# Altium project R_BOARD.PrjPcb
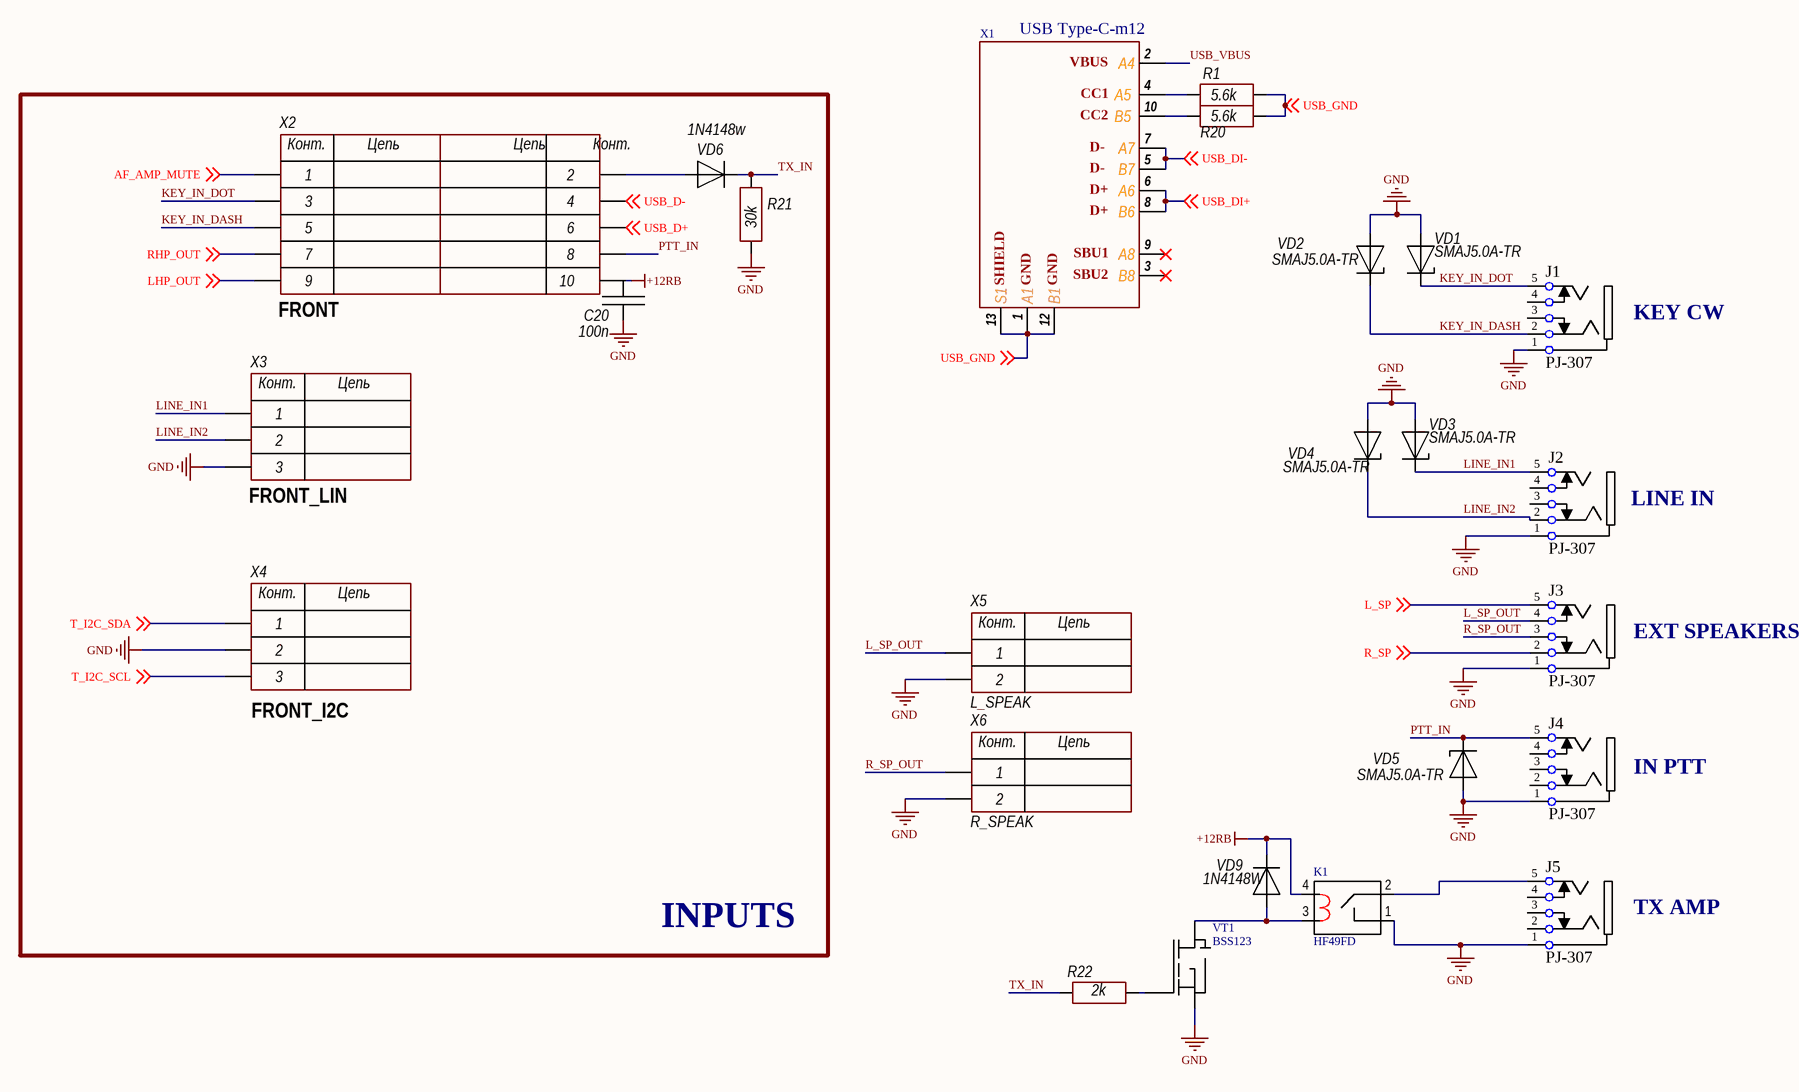
[diagram p0: RB_Conn.SchDoc]
3 sheets, 102 parts. Net scope: global (net labels, ports and power ports of the same name join across sheets).
Board file: PCB_R_Board.PcbDoc
Sheets:
  RB_Conn.SchDoc
  RB_Power.SchDoc
  RB_Audio.SchDoc

## Sheet RB_Conn.SchDoc
size 420 x 297 mm; ApprovedBy: UA3REO; Author: RU4PN; CompanyName: Wolf-2; DocumentNumber: R_BOARD - Connectors; Revision: 0.1; SheetNumber: 1; SheetTotal: 3

### Parts
C20  100n  [CH0805C]
J1  PJ-307  [PJ-307]
J2  PJ-307  [PJ-307]
J3  PJ-307  [PJ-307]
J4  PJ-307  [PJ-307]
J5  PJ-307  [PJ-307]
K1  HF49FD  [HF49FD]
R1  5.6k  [CH0805R]
R20  5.6k  [CH0805R]
R21  30k  [CH0805R]
R22  2k  [CH0805R]
VD1  SMAJ5.0A-TR  [SMA]
VD2  SMAJ5.0A-TR  [SMA]
VD3  SMAJ5.0A-TR  [SMA]
VD4  SMAJ5.0A-TR  [SMA]
VD5  SMAJ5.0A-TR  [SMA]
VD6  1N4148w  [SOD323]
VD9  1N4148W  [SOD123]
VT1  BSS123  [SOT23_132]
X1  USB Type-C-m12  [PCBComponent_1]
X2  FRONT  [CON: BH-10]
X3  FRONT_LIN  [CON: CWF-3]
X4  FRONT_I2C  [CON: CWF-3]
X5  L_SPEAK  [CON: PLS-2]
X6  R_SPEAK  [CON: PLS-2]

### Blocks framed on the sheet
INPUTS: C20 R21 VD6 X2-X4

### Nets
+12RB: K1.4 VD9.2 X2.10
GND: C20.1 J1.1 J2.1 J3.1 J4.1 J5.1 K1.1 R21.1 VD1.1(A) VD2.1(A) VD3.1(A) VD4.1(A) VD5.1(A) VT1.2(S) X3.3 X4.2 X5.2 X6.2
AF_AMP_MUTE: X2.1 ; off-sheet AF_AMP_MUTE
KEY_IN_DASH: J1.2 VD2.2(C) X2.5
KEY_IN_DOT: J1.5 VD1.2(C) X2.3
L_SP: J3.5 ; off-sheet L_SP
L_SP_OUT: J3.4 X5.1
LHP_OUT: X2.9 ; off-sheet LHP_OUT
LINE_IN1: J2.5 VD3.2(C) X3.1
LINE_IN2: J2.2 VD4.2(C) X3.2
PTT_IN: J4.5 VD5.2(C) X2.8
R_SP: J3.2 ; off-sheet R_SP
R_SP_OUT: J3.3 X6.1
RHP_OUT: X2.7 ; off-sheet RHP_OUT
T_I2C_SCL: X4.3 ; off-sheet T_I2C_SCL
T_I2C_SDA: X4.1 ; off-sheet T_I2C_SDA
TX_IN: R21.2 R22.1 VD6.2
USB_D+: X2.6 ; off-sheet USB_D+
USB_D-: X2.4 ; off-sheet USB_D-
USB_DI+: X1.6(A6) X1.8(B6) ; off-sheet USB_DI+
USB_DI-: X1.5(B7) X1.7(A7) ; off-sheet USB_DI-
USB_GND: R1.2 R20.2 X1.1(A1) X1.12(B1) X1.13(S1) ; off-sheet USB_GND
USB_VBUS: X1.2(A4)
NetJ5_5: J5.5 K1.2
NetK1_3: K1.3 VD9.1 VT1.3(D)
NetR1_1: R1.1 X1.4(A5)
NetR20_1: R20.1 X1.10(B5)
NetR22_2: R22.2 VT1.1(G)
NetVD6_1: VD6.1 X2.2

Not connected (* = marked no-connect by the designer): C20 2; J1 3 4; J2 3 4; J4 2 3 4; J5 2 3 4; X1 3(B8)* 9(A8)*

### Notes on the sheet
- KEY CW
- LINE IN
- EXT SPEAKERS
- IN PTT
- TX AMP
- Перв. примен.
- Справ. №
- Подп. и дата
- Инв. № дубл.
- Взам. инв. №
- Разраб.
- Изм.
- Лист
- № докум.
- Подп.
- Дата
- Лит.
- Масса
- Масштаб
- Пров.
- Т.контр.
- Листов
- Инв. № подл.
- Утв.
- Н.контр.
- 2.106-A3
- Копировал
- Формат А3
- (in symbol 2-Connector) Конт.; Цепь
- (in symbol 3-Connector) Конт.; Цепь
- (in symbol 10(2)-Connector) Конт.; Цепь
- (in symbol USB-C_2.0) VBUS; CC1; CC2; D-; D+; SBU1; SBU2; SHIELD; GND

### Library data of the parts
C20 = Capacitor: Manufacturer: *; Model: *; HelpURL: *; ComponentKind: *; Value: *
J1 = JACK_Audio-3: KEY
J2 = JACK_Audio-3: LIN
J3 = JACK_Audio-3: OUT_SPEAKERS
J4 = JACK_Audio-3: PTT_IN
J5 = JACK_Audio-3: TX
K1 = HF49FD 012-1H12
R1 R20-R22 = Resistor: Manufacturer: *; Model: *; HelpURL: *; ComponentKind: *; Value: *
VD1-VD5 = Diod Zener: ComponentKind: *; Manufacturer: *; Model: *; HelpURL: *
VD6 VD9 = Diod: ComponentKind: *; Manufacturer: *; Model: *; HelpURL: *
X1 = USB-C_2.0
X2 = 10(2)-Connector: Model: *; Manufacturer: *; HelpURL: *; ComponentKind: *
X3 X4 = 3-Connector: Model: *; Manufacturer: *; HelpURL: *; ComponentKind: *
X5 X6 = 2-Connector: Model: *; Manufacturer: *; HelpURL: *; ComponentKind: *

## Sheet RB_Power.SchDoc
size 420 x 297 mm; ApprovedBy: UA3REO; Author: RU4PN; CompanyName: Wolf 2; DocumentNumber: R_BOARD - Power; SheetNumber: 2; SheetTotal: 3
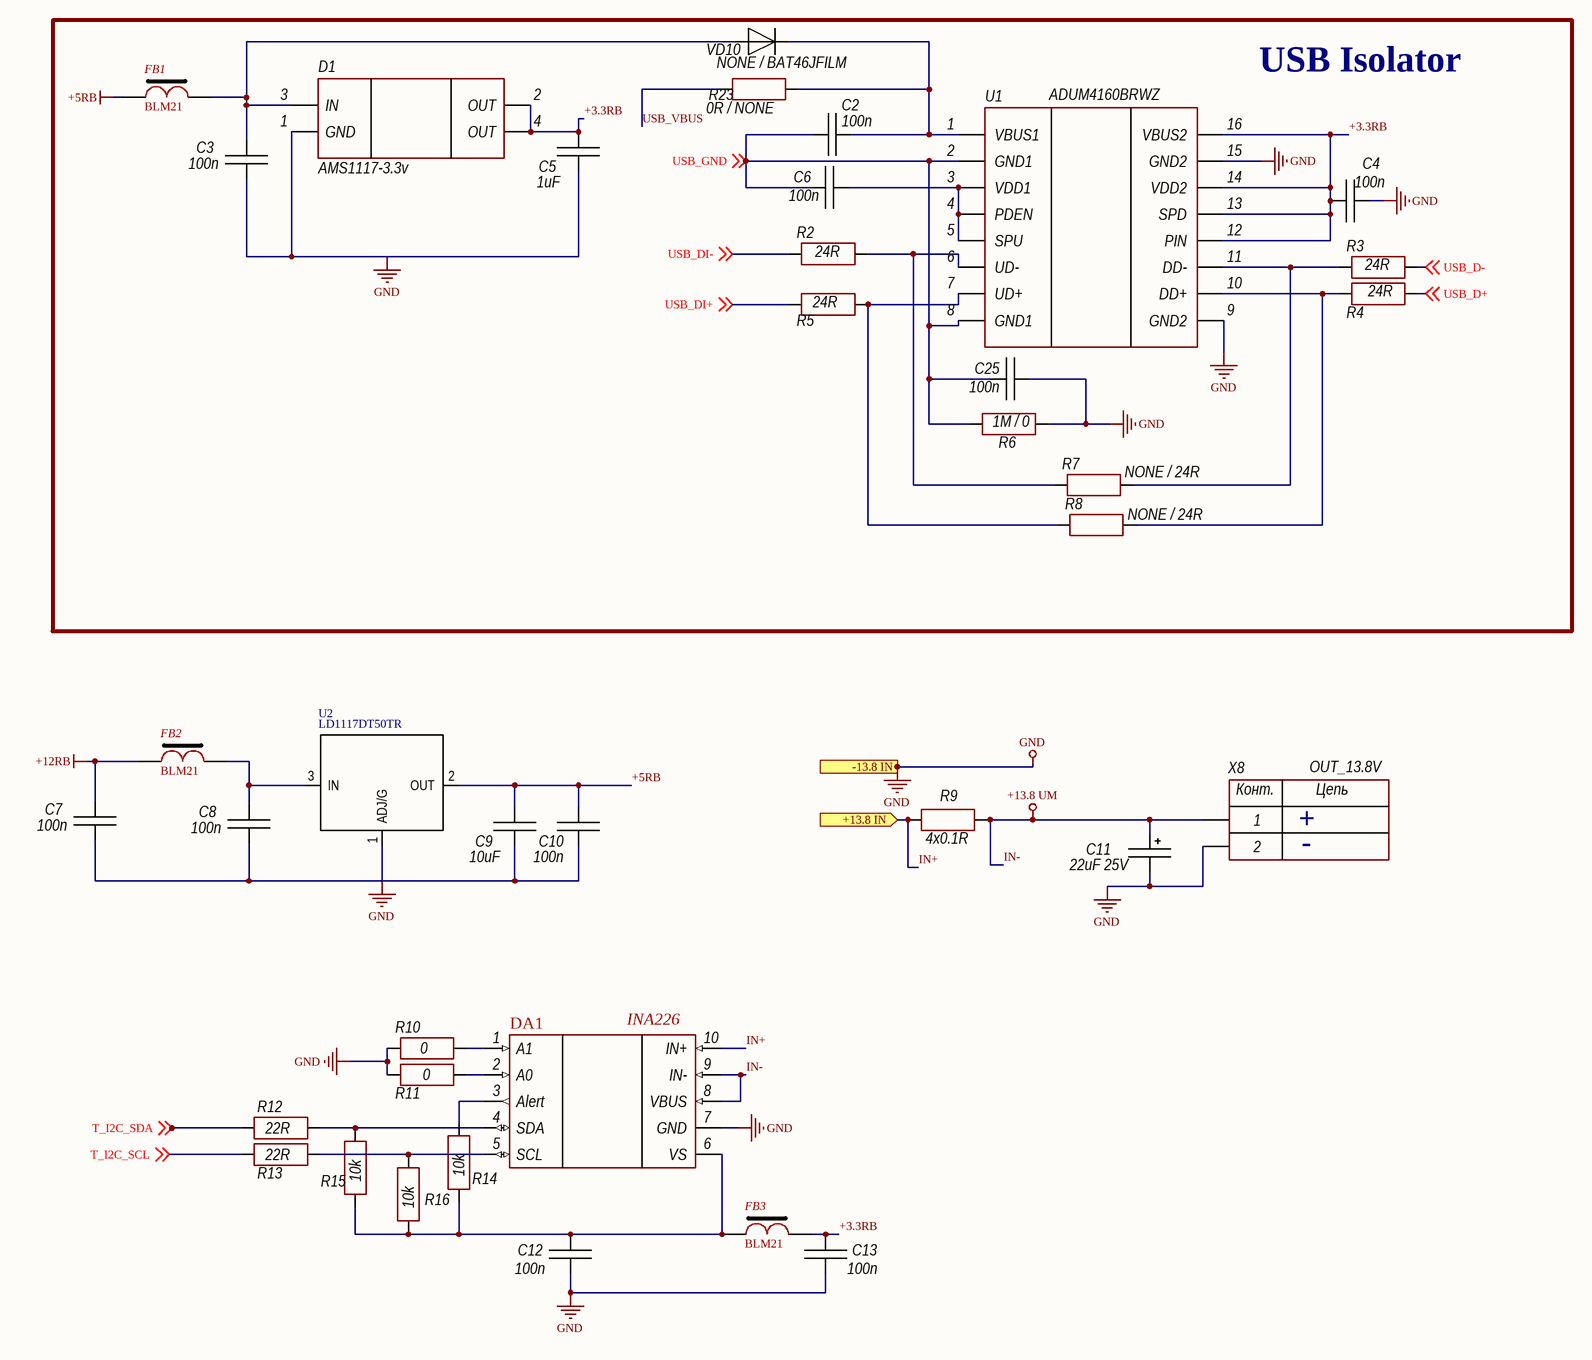
[diagram p1: RB_Power.SchDoc]

### Parts
C2  100n  [CH0805C]
C3  100n  [CH0805C]
C4  100n  [CH0805C]
C5  1uF  [CH0805C]
C6  100n  [CH0805C]
C7  100n  [CH0805C]
C8  100n  [CH0805C]
C9  10uF  [CH0805C]
C10  100n  [CH0805C]
C11  22uF 25V  [TANTAL_D]
C12  100n  [CH0805C]
C13  100n  [CH0805C]
C25  100n  [CH0805C]
D1  AMS1117-3.3v  [SOT223]
DA1  INA226  [10-TSSOP]
FB1  BLM21  [CH0805L]
FB2  BLM21  [CH0805L]
FB3  BLM21  [CH0805L]
R2  24R  [CH0805R]
R3  24R  [CH0805R]
R4  24R  [CH0805R]
R5  24R  [CH0805R]
R6  1M / 0  [CH0805R]
R7  NONE / 24R  [CH0805R]
R8  NONE / 24R  [CH0805R]
R9  4x0.1R  [R-DIP]
R10  0  [CH0805R]
R11  0  [CH0805R]
R12  22R  [CH0805R]
R13  22R  [CH0805R]
R14  10k  [CH0805R]
R15  10k  [CH0805R]
R16  10k  [CH0805R]
R23  0R / NONE  [CH0805R]
U1  ADUM4160BRWZ  [16-SOIC(W)]
U2  LD1117DT50TR  [TO-263-3(123)]
VD10  NONE / BAT46JFILM  [SOD323]
X8  OUT_13.8V  [CON: WF-02]

### Blocks framed on the sheet
USB Isolator: C2-C6 C25 D1 FB1 R2-R8 R23 U1 VD10

### Ports
+13.8 IN (in), -13.8 IN

### Nets
+5RB: C9.2 C10.2 FB1.2 U2.2(OUT)
+12RB: C7.2 FB2.2
+13.8 UM: C11.1 DA1.8(VBUS) DA1.9(IN-) R9.2 X8.1  [also labelled IN-]
GND: C3.1 C4.2 C5.1 C7.1 C8.1 C9.1 C10.1 C11.2 C12.1 C13.1 C25.2 D1.1(GND) DA1.7(GND) R6.2 R10.1 R11.1 U1.9(GND2) U1.15(GND2) U2.1(ADJ/G) X8.2 ; port -13.8 IN
+3.3RB: C4.1 C5.2 C13.2 D1.2(OUT) D1.4(OUT) FB3.1 U1.12(PIN) U1.13(SPD) U1.14(VDD2) U1.16(VBUS2)
IN+: DA1.10(IN+) R9.1 ; port +13.8 IN
T_I2C_SCL: R13.1 ; off-sheet T_I2C_SCL
T_I2C_SDA: R12.1 ; off-sheet T_I2C_SDA
USB_D+: R4.2 ; off-sheet USB_D+
USB_D-: R3.2 ; off-sheet USB_D-
USB_DI+: R5.1 ; off-sheet USB_DI+
USB_DI-: R2.1 ; off-sheet USB_DI-
USB_GND: C2.1 C6.1 C25.1 R6.1 U1.2(GND1) U1.8(GND1) ; off-sheet USB_GND
USB_VBUS: R23.1
NetC2_2: C2.2 R23.2 U1.1(VBUS1) VD10.2
NetC3_2: C3.2 D1.3(IN) FB1.1 VD10.1
NetC6_2: C6.2 U1.3(VDD1) U1.4(PDEN) U1.5(SPU)
NetC8_2: C8.2 FB2.1 U2.3(IN)
NetC12_2: C12.2 DA1.6(VS) FB3.2 R14.1 R15.1 R16.1
NetDA1_1: DA1.1(A1) R10.2
NetDA1_2: DA1.2(A0) R11.2
NetDA1_3: DA1.3(Alert) R14.2
NetDA1_4: DA1.4(SDA) R12.2 R15.2
NetDA1_5: DA1.5(SCL) R13.2 R16.2
NetR2_2: R2.2 R7.1 U1.6(UD-)
NetR3_1: R3.1 R7.2 U1.11(DD-)
NetR4_1: R4.1 R8.2 U1.10(DD+)
NetR5_2: R5.2 R8.1 U1.7(UD+)

### Notes on the sheet
- +
- -
- Перв. примен.
- Справ. №
- Подп. и дата
- Инв. № дубл.
- Взам. инв. №
- Разраб.
- Изм.
- Лист
- № докум.
- Подп.
- Дата
- Лит.
- Масса
- Масштаб
- Пров.
- Т.контр.
- Листов
- Инв. № подл.
- Утв.
- Н.контр.
- 2.106-A3
- Копировал
- Формат А3
- (in symbol 2-Connector) Конт.; Цепь

### Library data of the parts
C2-C10 C12 C13 C25 = Capacitor: Manufacturer: *; Model: *; HelpURL: *; ComponentKind: *; Value: *
C11 = TantalCap: Manufacturer: *; Model: *; HelpURL: *; ComponentKind: *; Value: *
D1 = NCP1117LPST50T3G: LDO; Manufacturer: ON Semiconductor; Model: NCP1117LPST50T3G; HelpURL: https://www.digikey.com/product-detail/en/on-semiconductor/NCP1117LPST50T3G/NCP1117LPST50T3GOSCT-ND/5801728; ComponentKind: SOT-223
FB1-FB3 = FB-1
R2-R16 R23 = Resistor: Manufacturer: *; Model: *; HelpURL: *; ComponentKind: *; Value: *
U1 = ADUM3160BRWZ: Isolator USB; Manufacturer: Analog Devices Inc.; Model: ADUM3160BRWZ; HelpURL: https://www.digikey.com/product-detail/en/analog-devices-inc/ADUM3160BRWZ/ADUM3160BRWZ-ND/2361054; ComponentKind: 16-SOIC
U2 = LM1084
VD10 = Diod: ComponentKind: *; Manufacturer: *; Model: *; HelpURL: *
X8 = 2-Connector: Model: *; Manufacturer: *; HelpURL: *; ComponentKind: *

## Sheet RB_Audio.SchDoc
size 420 x 297 mm; ApprovedBy: UA3REO; Author: RU4PN; CompanyName: Wolf 2; DocumentNumber: R_BOARD - Audio; SheetNumber: 3; SheetTotal: 3
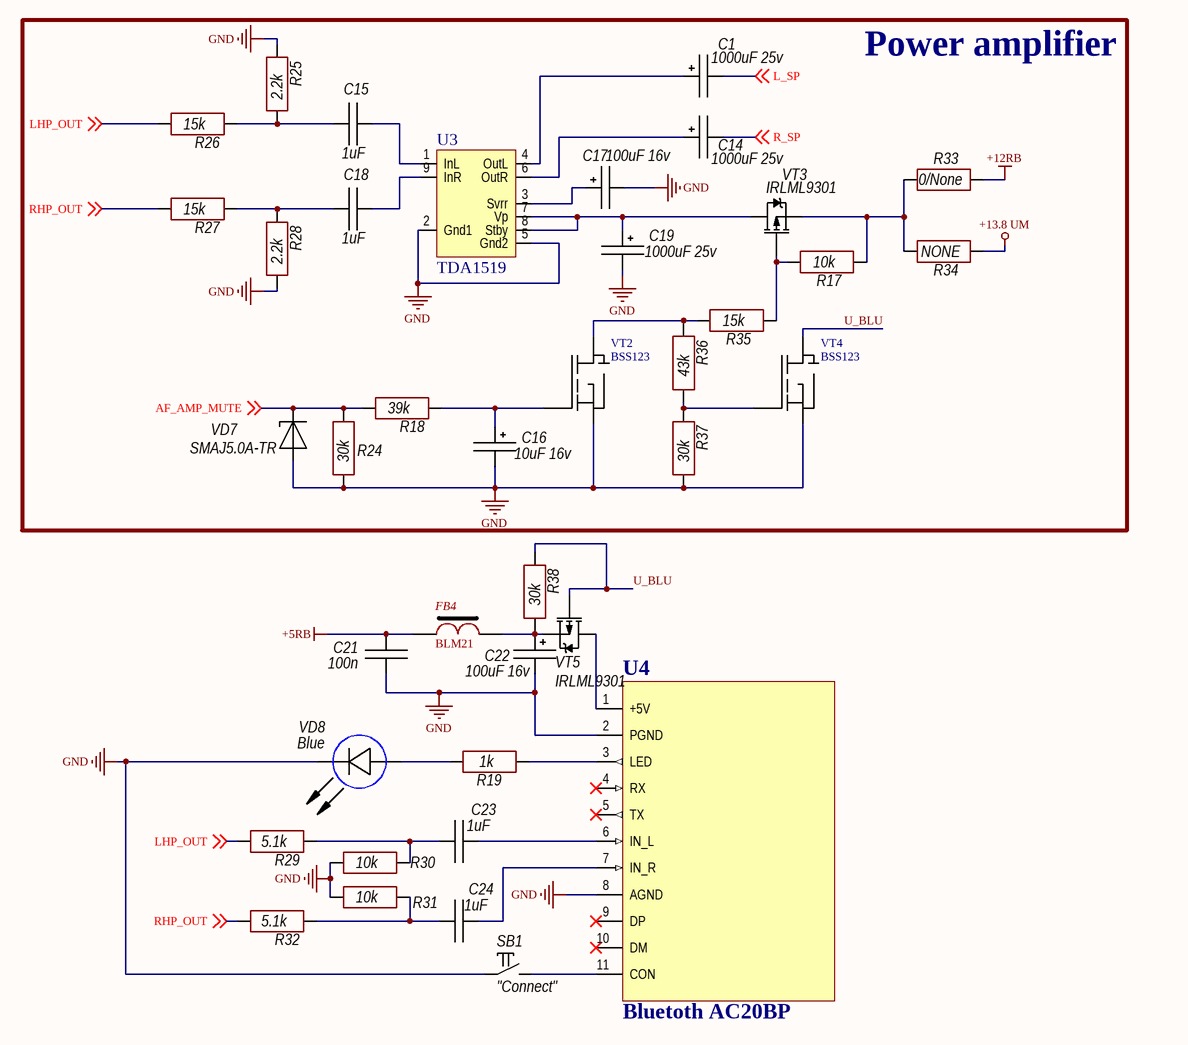
[diagram p2: RB_Audio.SchDoc]

### Parts
C1  1000uF 25v  [D10C5H12.5]
C14  1000uF 25v  [D10C5H12.5]
C15  1uF  [CH0805C]
C16  10uF 16v  [TANTAL_B]
C17  100uF 16v  [TANTAL_D]
C18  1uF  [CH0805C]
C19  1000uF 25v  [D10C5H12.5]
C21  100n  [CH0805C]
C22  100uF 16v  [D6.3C2.5H11]
C23  1uF  [CH0805C]
C24  1uF  [CH0805C]
FB4  BLM21  [CH0805L]
R17  10k  [CH0805R]
R18  39k  [CH0805R]
R19  1k  [CH0805R]
R24  30k  [CH0805R]
R25  2.2k  [CH0805R]
R26  15k  [CH0805R]
R27  15k  [CH0805R]
R28  2.2k  [CH0805R]
R29  5.1k  [CH0805R]
R30  10k  [CH0805R]
R31  10k  [CH0805R]
R32  5.1k  [CH0805R]
R33  0/None  [CH1206R]
R34  NONE  [CH1206R]
R35  15k  [CH0805R]
R36  43k  [CH0805R]
R37  30k  [CH0805R]
R38  30k  [CH0805R]
SB1  "Connect"  [BUT: 6x6 mm (R)]
U3  TDA1519  [SOT110B]
U4  Bluetoth AC20BP  [Bluetooth 11PIN]
VD7  SMAJ5.0A-TR  [SMA]
VD8  Blue  [CH0805LB]
VT2  BSS123  [SOT23_132]
VT3  IRLML9301  [SOT23_132]
VT4  BSS123  [SOT23_132]
VT5  IRLML9301  [SOT23_132]

### Blocks framed on the sheet
Power amplifier: C1 C14-C19 R17 R18 R24-R28 R33-R37 U3 VD7 VT2-VT4

### Nets
+5RB: C21.2 FB4.2
+12RB: R33.2
+13.8 UM: R34.2
GND: C16.2 C17.2 C19.2 C21.1 C22.2 R24.1 R25.2 R28.1 R30.1 R31.1 R37.1 SB1.1 U3.2(Gnd1) U3.5(Gnd2) U4.2(PGND) U4.8(AGND) VD7.1(A) VD8.2(C) VT2.2(S) VT4.2(S)
AF_AMP_MUTE: R18.1 R24.2 VD7.2(C) ; off-sheet AF_AMP_MUTE
L_SP: C1.2 ; off-sheet L_SP
LHP_OUT: R26.1 R29.1 ; off-sheet LHP_OUT
R_SP: C14.2 ; off-sheet R_SP
RHP_OUT: R27.1 R32.1 ; off-sheet RHP_OUT
U_BLU: R38.2 VT4.3(D) VT5.1(G)
NetC1_1: C1.1 U3.4(OutL)
NetC14_1: C14.1 U3.6(OutR)
NetC15_1: C15.1 R25.1 R26.2
NetC15_2: C15.2 U3.1(InL)
NetC16_1: C16.1 R18.2 VT2.1(G)
NetC17_1: C17.1 U3.3(Svrr)
NetC18_1: C18.1 R27.2 R28.2
NetC18_2: C18.2 U3.9(InR)
NetC19_1: C19.1 U3.7(Vp) U3.8(Stby) VT3.3(D)
NetC22_1: C22.1 FB4.1 VT5.2(S)
NetC23_1: C23.1 R29.2 R30.2
NetC23_2: C23.2 U4.6(IN_L)
NetC24_1: C24.1 R31.2 R32.2
NetC24_2: C24.2 U4.7(IN_R)
NetR17_1: R17.1 R35.2 VT3.1(G)
NetR17_2: R17.2 R33.1 R34.1 VT3.2(S)
NetR19_1: R19.1 VD8.1(A)
NetR19_2: R19.2 U4.3(LED)
NetR35_1: R35.1 R36.2 VT2.3(D)
NetR36_1: R36.1 R37.2 VT4.1(G)
NetSB1_2: SB1.2 U4.11(CON)
NetU4_1: U4.1(+5V) VT5.3(D)

Not connected (* = marked no-connect by the designer): R38 1; U4 4(RX)* 5(TX)* 9(DP)* 10(DM)*

### Notes on the sheet
- Перв. примен.
- Справ. №
- Подп. и дата
- Инв. № дубл.
- Взам. инв. №
- Разраб.
- Изм.
- Лист
- № докум.
- Подп.
- Дата
- Лит.
- Масса
- Масштаб
- Пров.
- Т.контр.
- Листов
- Инв. № подл.
- Утв.
- Н.контр.
- 2.106-A3
- Копировал
- Формат А3

### Library data of the parts
C1 C14 C19 C22 = AlumCap: Manufacturer: *; Model: *; HelpURL: *; ComponentKind: *; Value: *
C15 C18 C21 C23 C24 = Capacitor: Manufacturer: *; Model: *; HelpURL: *; ComponentKind: *; Value: *
C16 C17 = TantalCap: Manufacturer: *; Model: *; HelpURL: *; ComponentKind: *; Value: *
FB4 = FB-1
R17-R19 R24-R38 = Resistor: Manufacturer: *; Model: *; HelpURL: *; ComponentKind: *; Value: *
SB1 = Tactile switches: 6x6 mm; Manufacturer: *; Model: *; HelpURL: *; ComponentKind: *
U4 = Bluetoth AC20BP Module
VD7 = Diod Zener: ComponentKind: *; Manufacturer: *; Model: *; HelpURL: *
VD8 = LED: Manufacturer: *; Model: *; HelpURL: *; ComponentKind: *; Value: *
VT3 VT5 = IRLML9301: Mosfet; Model: *; Manufacturer: *; ComponentKind: *; HelpURL: *

## Nets that join several sheets
+5RB: RB_Power (C9.2 C10.2 FB1.2 U2.2), RB_Audio (C21.2 FB4.2)
+12RB: RB_Conn (K1.4 VD9.2 X2.10), RB_Power (C7.2 FB2.2), RB_Audio (R33.2)
+13.8 UM: RB_Power (5 pins), RB_Audio (R34.2)
GND: RB_Conn (18 pins), RB_Power (20 pins), RB_Audio (20 pins)
AF_AMP_MUTE: RB_Conn (X2.1), RB_Audio (R18.1 R24.2 VD7.2)
L_SP: RB_Conn (J3.5), RB_Audio (C1.2)
LHP_OUT: RB_Conn (X2.9), RB_Audio (R26.1 R29.1)
R_SP: RB_Conn (J3.2), RB_Audio (C14.2)
RHP_OUT: RB_Conn (X2.7), RB_Audio (R27.1 R32.1)
T_I2C_SCL: RB_Conn (X4.3), RB_Power (R13.1)
T_I2C_SDA: RB_Conn (X4.1), RB_Power (R12.1)
USB_D+: RB_Conn (X2.6), RB_Power (R4.2)
USB_D-: RB_Conn (X2.4), RB_Power (R3.2)
USB_DI+: RB_Conn (X1.6 X1.8), RB_Power (R5.1)
USB_DI-: RB_Conn (X1.5 X1.7), RB_Power (R2.1)
USB_GND: RB_Conn (5 pins), RB_Power (6 pins)
USB_VBUS: RB_Conn (X1.2), RB_Power (R23.1)